# EAGLE design sumorobot-shield-pcb (EAGLE 6.5.0)
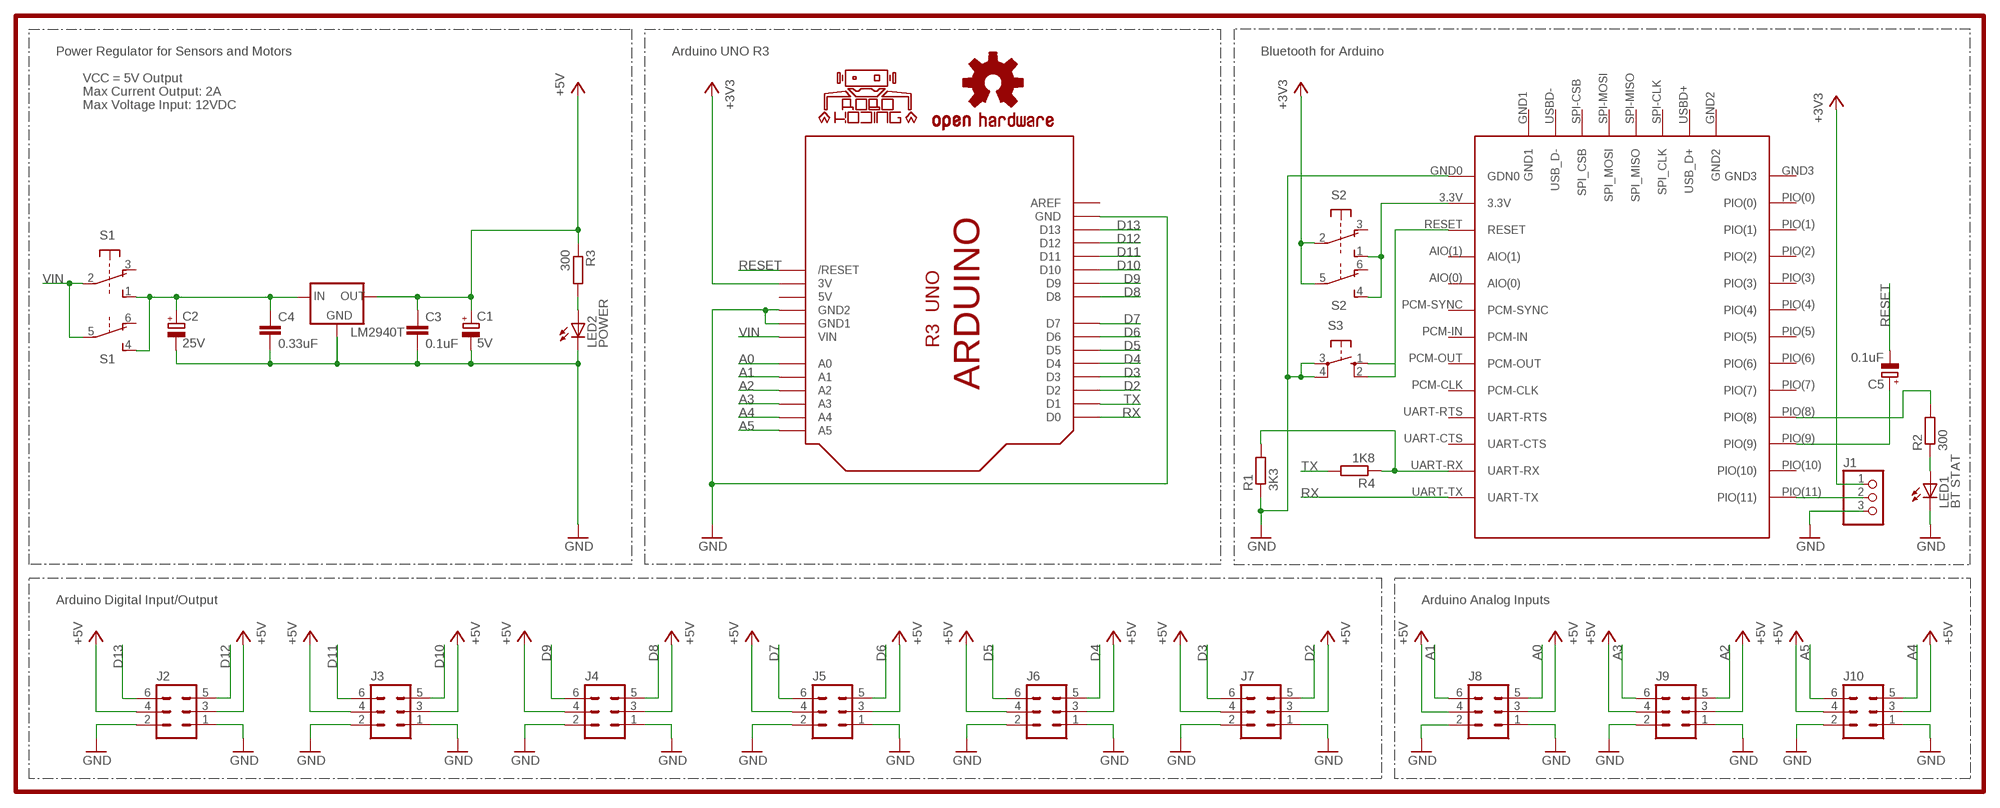
[diagram p0: schematic, sheet 1]

## Parts
BLUETOOTH  MODULE  SKU_80711  [SKU_80711]
C1  5V  CPOL-EUE3.5-8  [E3,5-8]
C2  25V  CPOL-EUE2.5-7  [E2,5-7]
C3  0.1uF  C-EU025-024X044  [C025-024X044]
C4  0.33uF  C-EU025-024X044  [C025-024X044]
C5  0.1uF  CPOL-EUE5-4  [E5-4]
J1  PINHD-1X3  [1X03]
J2  MA03-2  [MA03-2]
J3  MA03-2  [MA03-2]
J4  MA03-2  [MA03-2]
J5  MA03-2  [MA03-2]
J6  MA03-2  [MA03-2]
J7  MA03-2  [MA03-2]
J8  MA03-2  [MA03-2]
J9  MA03-2  [MA03-2]
J10  MA03-2  [MA03-2]
LED1  BT STAT  LED5MM  [LED5MM]
LED2  POWER  LED5MM  [LED5MM]
LM2940T  78XXL  [78XXL]
LOGO1  ROBOKODING-LOGOL  [ROBOKODING-LOGO-L]
LOGO2  OSHW-LOGOL  [OSHW-LOGO-L]
R1  3K3  R-EU_0204/7  [0204/7]
R2  300  R-EU_0204/7  [0204/7]
R3  300  R-EU_0204/7  [0204/7]
R4  1K8  R-EU_0204/7  [0204/7]
S1  9077-2  [9077-2]
S2  9077-2  [9077-2]
S3  10-XX  [B3F-10XX]
U$1  SUMOINO-SHIELD  [SUMOINO-SHIELD]

## Nets
+3V3: J1.1 S2.2(1:P) S2.5(2:P) U$1.3V
A0: J8.5 U$1.A0
A1: J8.6 U$1.A1
A2: J9.5 U$1.A2
A3: J9.6 U$1.A3
A4: J10.5 U$1.A4
A5: J10.6 U$1.A5
D2: J7.5 U$1.D2
D3: J7.6 U$1.D3
D4: J6.5 U$1.D4
D5: J6.6 U$1.D5
D6: J5.5 U$1.D6
D7: J5.6 U$1.D7
D8: J4.5 U$1.D8
D9: J4.6 U$1.D9
D10: J3.5 U$1.D10
D11: J3.6 U$1.D11
D12: J2.5 U$1.D12
D13: J2.6 U$1.D13
GND: BLUETOOTH.GND0(GDN0) C1.- C2.- C3.2 C4.2 J1.3 J2.1 J2.2 J3.1 J3.2 J4.1 J4.2 J5.1 J5.2 J6.1 J6.2 J7.1 J7.2 J8.1 J8.2 J9.1 J9.2 J10.1 J10.2 LED1.K(C) LED2.K(C) LM2940T.GND R1.1 S3.3(P) S3.4(P1) U$1.GND U$1.GND1 U$1.GND2
N$1: BLUETOOTH.3.3V S2.1(1:S) S2.4(2:S)
N$2: BLUETOOTH.RESET S3.1(S) S3.2(S1)
N$3: LED2.A R3.2
N$4: BLUETOOTH.PIO(9) C5.+
N$5: C2.+ C4.1 LM2940T.IN S1.1(1:S) S1.4(2:S)
N$10: BLUETOOTH.PIO(8) R2.2
N$14: BLUETOOTH.UART-RX R1.2 R4.1
N$15: LED1.A R2.1
N$18: BLUETOOTH.PIO(11) J1.2
RESET: C5.- U$1.RESET(/RESET)
RX: BLUETOOTH.UART-TX U$1.D0
TX: R4.2 U$1.D1
VCC: C1.+ C3.1 J2.3 J2.4 J3.3 J3.4 J4.3 J4.4 J5.3 J5.4 J6.3 J6.4 J7.3 J7.4 J8.3 J8.4 J9.3 J9.4 J10.3 J10.4 LM2940T.OUT R3.1 ; supply symbol labelled +5V
VIN: S1.2(1:P) S1.5(2:P) U$1.VIN
Unconnected: BLUETOOTH.AIO(0) BLUETOOTH.AIO(1) BLUETOOTH.GND1 BLUETOOTH.GND2 BLUETOOTH.GND3 BLUETOOTH.PCM-CLK BLUETOOTH.PCM-IN BLUETOOTH.PCM-OUT BLUETOOTH.PCM-SYNC BLUETOOTH.PIO(0) BLUETOOTH.PIO(1) BLUETOOTH.PIO(2) BLUETOOTH.PIO(3) BLUETOOTH.PIO(4) BLUETOOTH.PIO(5) BLUETOOTH.PIO(6) BLUETOOTH.PIO(7) BLUETOOTH.PIO(10) BLUETOOTH.SPI-CLK(SPI_CLK) BLUETOOTH.SPI-CSB(SPI_CSB) BLUETOOTH.SPI-MISO(SPI_MISO) BLUETOOTH.SPI-MOSI(SPI_MOSI) BLUETOOTH.UART-CTS BLUETOOTH.UART-RTS BLUETOOTH.USBD+(USB_D+) BLUETOOTH.USBD-(USB_D-) S1.3(1:O) S1.6(2:O) S2.3(1:O) S2.6(2:O) U$1.AREF

## Notes on the sheet
- Power Regulator for Sensors and Motors | Arduino UNO R3 | Bluetooth for Arduino
- VCC = 5V Output
- Max Current Output: 2A
- Max Voltage Input: 12VDC
- Arduino Digital Input/Output | Arduino Analog Inputs

## Power pins joined to a net without a drawn wire
5V: U$1.5V

## Library data of the parts
BLUETOOTH = Bluetooth_serial:SKU_80711
C1 C2 C5 = rcl:CPOL-EU: POLARIZED CAPACITOR, European symbol
C3 C4 = rcl:C-EU: CAPACITOR, European symbol
J1 = pinhead:PINHD-1X3: PIN HEADER
J2-J10 = con-lstb:MA03-2: PIN HEADER; OC_FARNELL: unknown; OC_NEWARK: unknown
LED1 LED2 = led:LED: LED OSRAM: - CHIPLED LG R971, LG N971, LY N971, LG Q971, LY Q971, LO R971, LY R971 LH N974, LH R974 LS Q976, LO Q976, LY Q976 LO Q996 - Hyper CHIPLED LW Q18S LB Q993, LB Q99A, LB R99A - SideLED LS A670, LO A670, LY A670, LG A670, LP A670 LB A673, LV A673, LT A673, LW A673 LH A674 LY A675 LS A676, LA A676, LO A676, LY A676, LW A676 LS A679, LY A679, LG A679 - Hyper Micro SIDELED® LS Y876, LA Y876, LO Y876, LY Y876 LT Y87S - SmartLED LW L88C, LW L88S LB L89C, LB L89S, LG L890 LS L89K, LO L89K, LY L89K LS L896, LA L896, LO L896, LY L896 - TOPLED LS T670, LO T670, LY T670, LG T670, LP T670 LSG T670, LSP T670, LSY T670, LOP T670, LYG T670 LG T671, LOG T671, LSG T671 LB T673, LV T673, LT T673, LW T673 LH T674 LS T676, LA T676, LO T676, LY T676, LB T676, LH T676, LSB T676, LW T676 LB T67C, LV T67C, LT T67C, LS T67K, LO T67K, LY T67K, LW E67C LS E67B, LA E67B, LO E67B, LY E67B, LB E67C, LV E67C, LT E67C LW T67C LS T679, LY T679, LG T679 LS T770, LO T770, LY T770, LG T770, LP T770 LB T773, LV T773, LT T773, LW T773 LH T774 LS E675, LA E675, LY E675, LS T675 LS T776, LA T776, LO T776, LY T776, LB T776 LHGB T686 LT T68C, LB T68C - Hyper Mini TOPLED® LB M676 - Mini TOPLED Santana® LG M470 LS M47K, LO M47K, LY M47K Source: http://www.osram.convergy.de LUXEON: - LUMILED® LXK2-PW12-R00, LXK2-PW12-S00, LXK2-PW14-U00, LXK2-PW14-V00 LXK2-PM12-R00, LXK2-PM12-S00, LXK2-PM14-U00 LXK2-PE12-Q00, LXK2-PE12-R00, LXK2-PE12-S00, LXK2-PE14-T00, LXK2-PE14-U00 LXK2-PB12-K00, LXK2-PB12-L00, LXK2-PB12-M00, LXK2-PB14-N00, LXK2-PB14-P00, LXK2-PB14-Q00 LXK2-PR12-L00, LXK2-PR12-M00, LXK2-PR14-Q00, LXK2-PR14-R00 LXK2-PD12-Q00, LXK2-PD12-R00, LXK2-PD12-S00 LXK2-PH12-R00, LXK2-PH12-S00 LXK2-PL12-P00, LXK2-PL12-Q00, LXK2-PL12-R00 Source: www.luxeon.com KINGBRIGHT: KA-3528ASYC Source: www.kingbright.com
LM2940T = v-reg:78XXL: VOLTAGE REGULATOR
LOGO1 = robokoding-logo:ROBOKODING-LOGO: Robokoding logo This logo indicates that the piece of hardware was developed by the RoboKoding community. RoboKoding is a organisation that focuses on teaching everyone building and programming robots: http://www.robokoding.com
LOGO2 = SparkFun-Aesthetics:OSHW-LOGO: Open Source Hardware Logo This logo indicates the piece of hardware it is found on incorporates a OSHW license and/or adheres to the definition of open source hardware found here: http://freedomdefined.org/OSHW
R1-R4 = rcl:R-EU_: RESISTOR, European symbol
S1 S2 = switch-misc:9077-2: MARQUARDT SWITCH 9077.0200 Distributor: Buerklin <https://www.buerklin.com/default.asp?event=ShowArtikel%2812G2822%29&l=d&jump=ArtNr_12G2822>
S3 = switch-omron:10-XX: OMRON SWITCH; MPN: B3F-1000; OC_FARNELL: 176432; OC_NEWARK: 36M3542
U$1 = arduino_uno:SUMOINO-SHIELD: Sumoino shield Sumoino shield for Arduino Uno, the shield adds bluetooth connectivity and an additional voltage regulator for motors.

## Board
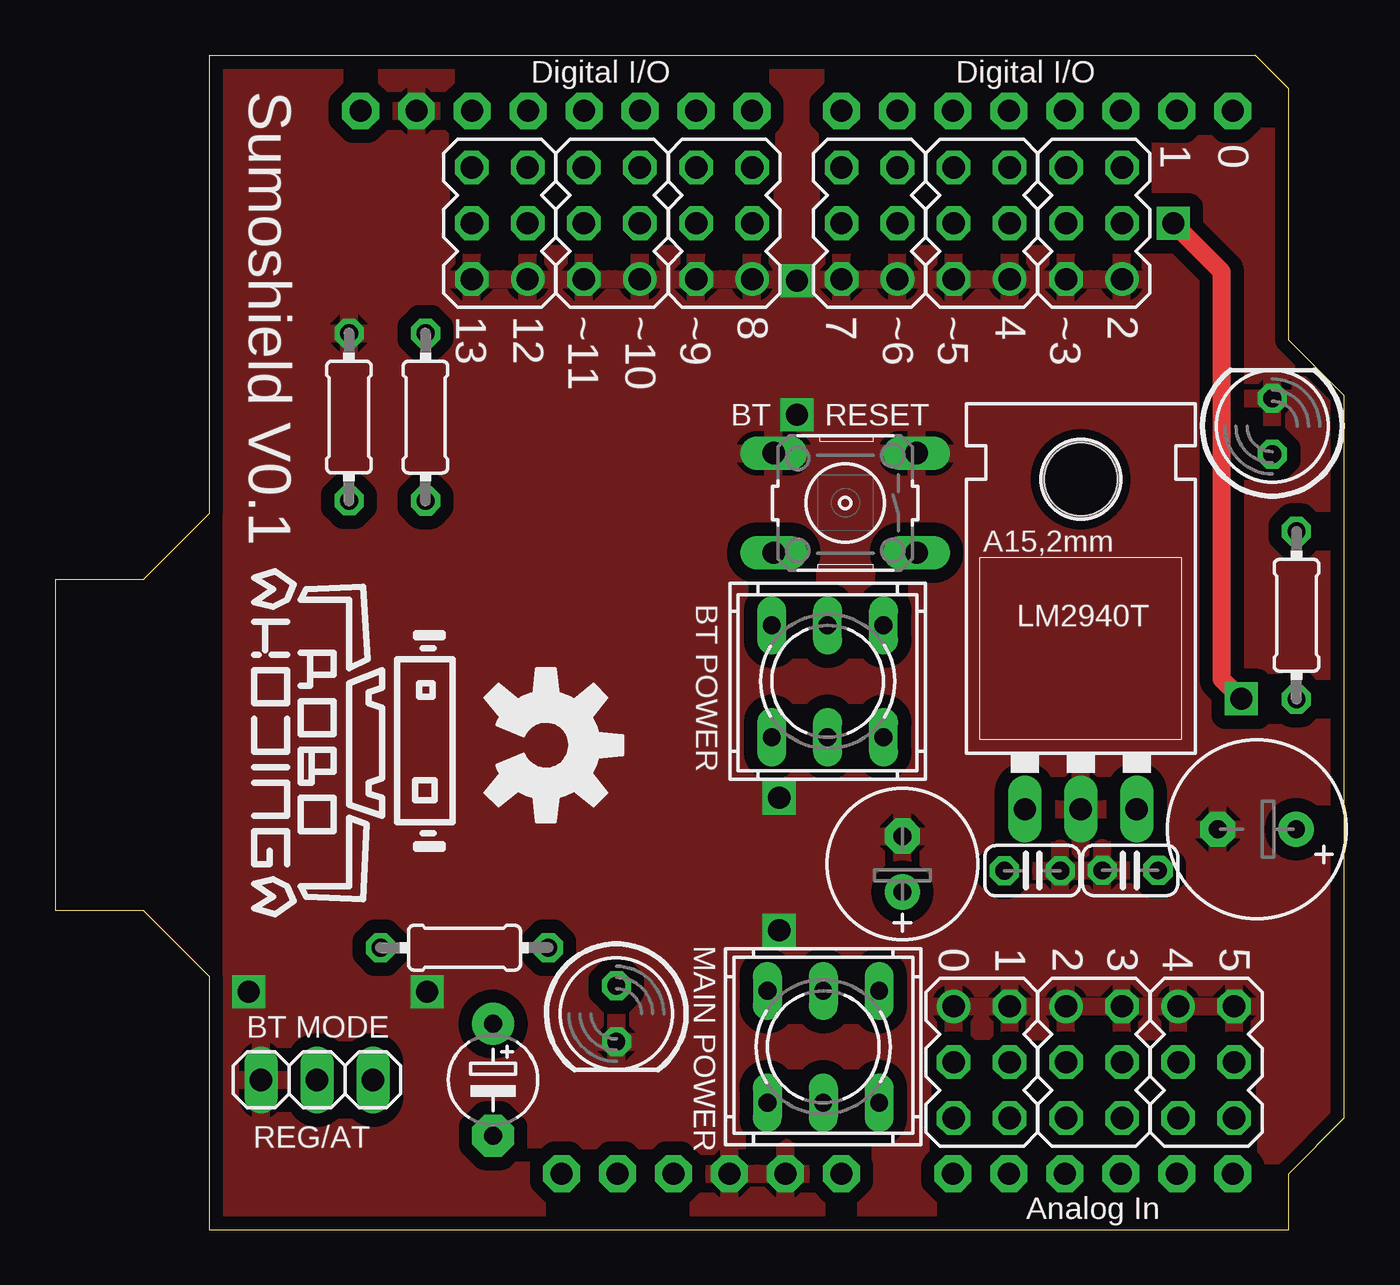
[diagram p1: board, top side]
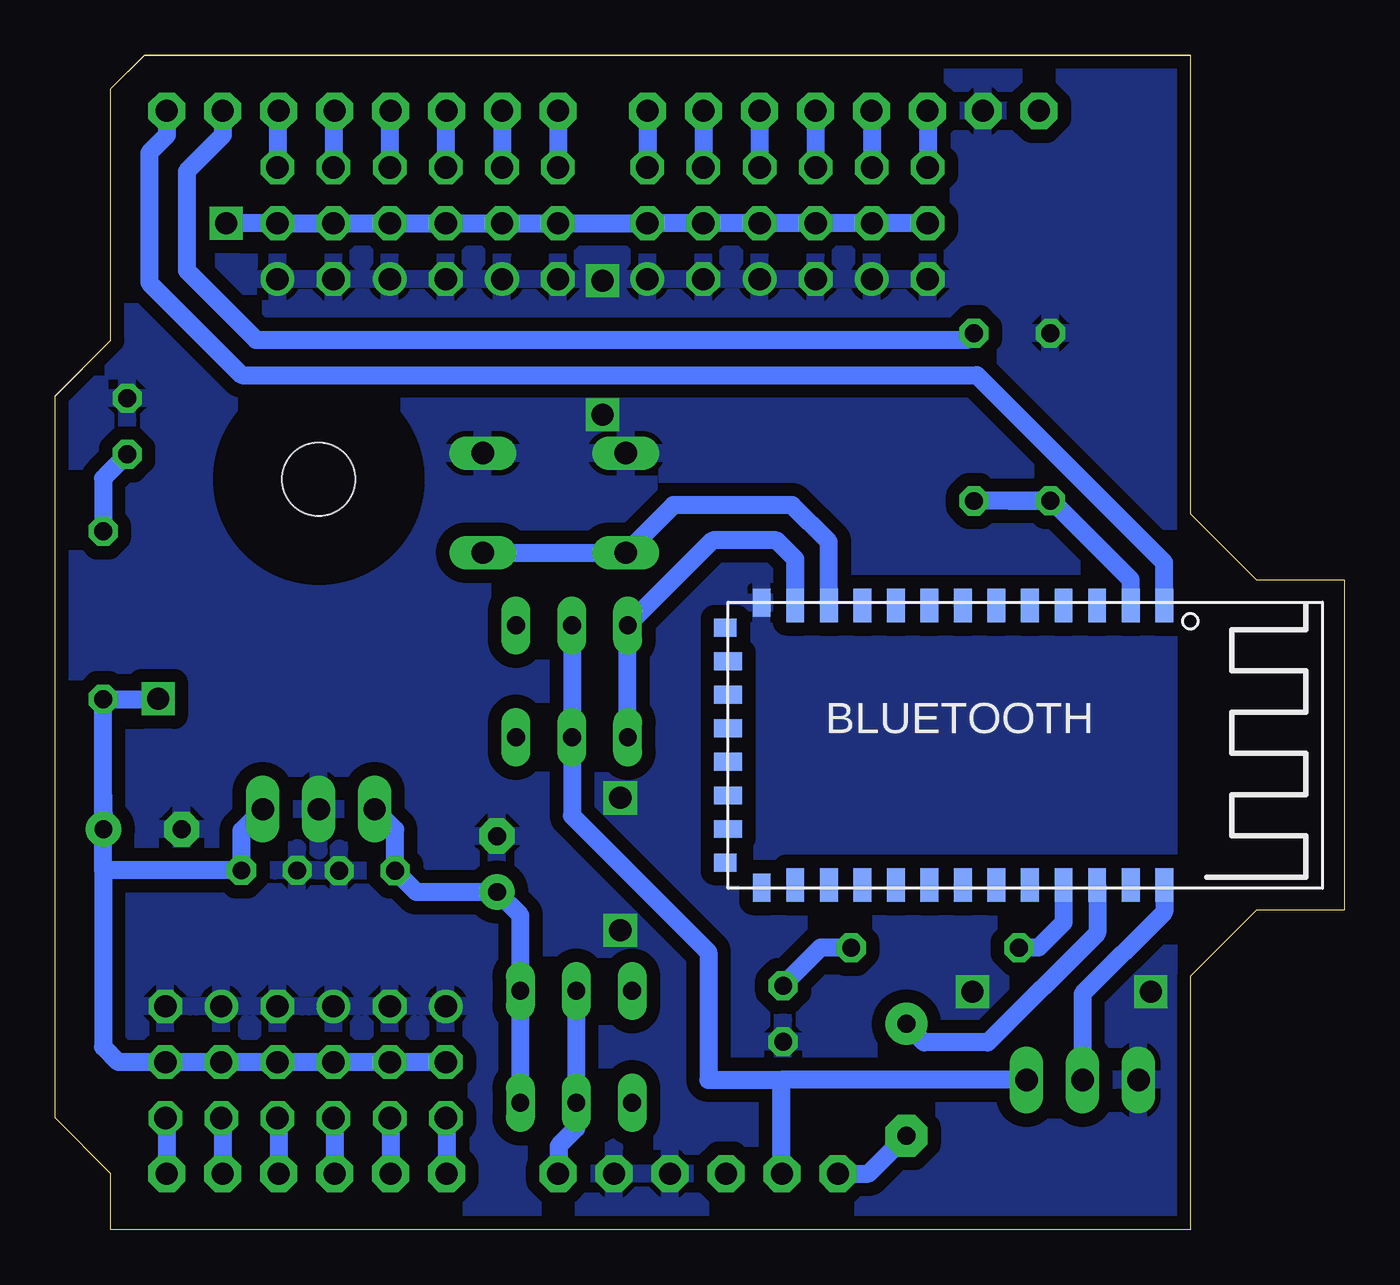
[diagram p2: board, bottom side, seen from below]

Size 58.58 x 53.34 mm. Coordinates in mm from the lower left corner, seen from the top.
Outline: 7,0 56.04,0 56.04,2.54 58.58,5.08 58.58,37.86 56.04,40.39 56.04,51.82 54.52,53.34 7,53.34 7,32.5 4,29.5 0,29.5 0,14.5 4,14.5 7,11.5 7,0
Copper layers (1*16): Top 0.035mm / dielectric 1.5mm / Bottom 0.035mm
Design rules "dirt_cheap_dirty_boards.v1": minimum track width 5mil, minimum drill 12mil, track to track 5mil, track to pad 5mil, pad to pad 5mil, via to via 5mil, smd to smd 0mil, copper to edge 10mil, drill to drill 10mil, minimum pad ring 10mil, minimum via ring 6mil, stop-mask expansion 2mil, vias tented up to drill 25mil, thermal gap 10mil

### Footprints (pad centres in the part's own frame; a part is rotated, then mirrored left to right if it is on the bottom)
SKU_80711 = smd 1.524 x 0.813: 3.3V -6.35,3.048; AIO(0) -6.35,7.62; AIO(1) -6.35,6.096; PCM-CLK -6.35,13.716; PCM-IN -6.35,10.668; PCM-OUT -6.35,12.192; PCM-SYNC -6.35,9.144; PIO(0) 6.35,3.048; PIO(1) 6.35,4.572; PIO(2) 6.35,6.096; PIO(3) 6.35,7.62; PIO(4) 6.35,9.144; PIO(5) 6.35,10.668; PIO(6) 6.35,12.192; PIO(7) 6.35,13.716; PIO(8) 6.35,15.24; PIO(9) 6.35,16.764; PIO(10) 6.35,18.288; PIO(11) 6.35,19.812; RESET -6.35,4.572; UART-CTS -6.35,16.764; UART-RTS -6.35,15.24; UART-RX -6.35,18.288; UART-TX -6.35,19.812 | smd 1.27 x 0.813: GND0 -6.477,1.524; GND3 6.477,1.524 | smd 0.813 x 1.016: GND1 -5.334,-0.127; GND2 5.334,-0.127 | smd 0.813 x 1.27: SPI-CLK 2.286,0; SPI-CSB -2.286,0; SPI-MISO 0.762,0; SPI-MOSI -0.762,0; USBD+ 3.81,0; USBD- -3.81,0
E3,5-8 = drill 0.813 pad 1.6: + -1.778,0 | drill 0.813 pad 1.6 octagon: - 1.778,0
E2,5-7 = drill 0.813 pad 1.6: + -1.27,0 | drill 0.813 pad 1.6 octagon: - 1.27,0
C025-024X044 = drill 0.813 octagon: 1 -1.27,0; 2 1.27,0
E5-4 = drill 0.813 pad 1.905: + -2.54,0 | drill 0.813 pad 1.905 octagon: - 2.54,0
1X03 = drill 1.016 long: 1 -2.54,0; 2 0,0; 3 2.54,0
MA03-2 = drill 1.016: 1 -2.54,-1.27 | drill 1.016 octagon: 2 -2.54,1.27; 3 0,-1.27; 4 0,1.27; 5 2.54,-1.27; 6 2.54,1.27
LED5MM = drill 0.813 octagon: A -1.27,0; K 1.27,0
78XXL = drill 1.016 long: GND 0,-3.81; IN -2.54,-3.81; OUT 2.54,-3.81 | hole 3.302: 0,11.176
0204/7 = drill 0.813 octagon: 1 -3.81,0; 2 3.81,0
9077-2 = drill 0.813 long: 1 -2.54,2.54; 2 0,2.54; 3 2.54,2.54; 4 -2.54,-2.54; 5 0,-2.54; 6 2.54,-2.54
B3F-10XX = drill 1.016 long: 1 -3.251,2.261; 2 3.251,2.261; 3 -3.251,-2.261; 4 3.251,-2.261
SUMOINO-SHIELD = drill 1 pad 1.676 octagon: 3V 18.56,2.54; 5V 21.1,2.54; A0 33.8,2.54; A1 36.34,2.54; A2 38.88,2.54; A3 41.42,2.54; A4 43.96,2.54; A5 46.5,2.54; AREF 6.876,50.8; D0 46.5,50.8; D1 43.96,50.8; D2 41.42,50.8; D3 38.88,50.8; D4 36.34,50.8; D5 33.8,50.8; D6 31.26,50.8; D7 28.72,50.8; D8 24.656,50.8; D9 22.116,50.8; D10 19.576,50.8; D11 17.036,50.8; D12 14.496,50.8; D13 11.956,50.8; GND 9.416,50.8; GND1 26.18,2.54; GND2 23.64,2.54; RESET 16.02,2.54; VIN 28.72,2.54

### Placement (x,y rotation side)
BLUETOOTH  28,22 270 bottom
C1  54.6,18.18 180 top
C2  38.5,16.6 90 top
C3  48.84,16.31 180 top
C4  44.4,16.3 0 top
C5  19.9,6.8 270 top
J1  11.9,6.8 180 top
J2  20.2,45.7 90 top
J3  25.3,45.7 90 top
J4  30.4,45.7 90 top
J5  37,45.7 90 top
J6  42.1,45.7 90 top
J7  47.2,45.7 90 top
J8  42.1,7.6 270 top
J9  47.2,7.6 270 top
J10  52.3,7.6 270 top
LED1  25.5,9.8 270 top
LED2  55.3,36.48 90 top
LM2940T  46.6,22.9 0 top
LOGO1  8.85,30.1 270 top
LOGO2  22.3,22 270 top
R1  13.35,36.9 270 top
R2  18.6,12.8 180 top
R3  56.4,27.9 90 top
R4  16.83,36.9 90 top
S1  34.9,8.3 180 top
S2  35.1,24.9 0 top
S3  35.9,33 180 top
U$1  7,0 0 top

### Tracks (layer width: path | path; a pad name or v marks a point on that pad's centre or on a via)
+3V3
  Bottom 0.813: J1.1 25.6,6.8 | 25.6,6.8 25.6,2.58 U$1.3V | S2.2 S2.5 35.1,18.8 28.9,12.6 28.9,6.8 25.6,6.8
A0
  Bottom 0.813: J8.5 40.8,5.06 U$1.A0
A1
  Bottom 0.813: J8.6 43.34,5.06 U$1.A1
A2
  Bottom 0.813: J9.5 45.88,5.06 U$1.A2
A3
  Bottom 0.813: J9.6 48.42,5.06 U$1.A3
A4
  Bottom 0.813: J10.5 50.96,5.06 U$1.A4
A5
  Bottom 0.813: J10.6 53.5,5.06 U$1.A5
D2
  Bottom 0.813: U$1.D2 48.47,50.75 J7.5
D3
  Bottom 0.813: U$1.D3 45.93,50.75 J7.6
D4
  Bottom 0.813: U$1.D4 43.37,50.77 J6.5
D5
  Bottom 0.813: U$1.D5 40.83,50.77 J6.6
D6
  Bottom 0.813: U$1.D6 J5.5
D7
  Bottom 0.813: U$1.D7 J5.6
D8
  Bottom 0.813: U$1.D8 J4.5
D9
  Bottom 0.813: U$1.D9 J4.6
D10
  Bottom 0.813: U$1.D10 J3.5
D11
  Bottom 0.813: U$1.D11 J3.6
D12
  Bottom 0.813: U$1.D12 21.47,50.8 J2.5
D13
  Bottom 0.813: U$1.D13 18.93,50.8 J2.6
GND  (via drill 1)
  other vias: 33.7,43.1 33.7,37 16.9,10.8 8.8,10.8 32.9,13.6 32.9,19.6
  pour Bottom (isolate 0.61): 8,0 59,0 59,54 8,54
  pour Top (isolate 0.61): 8,54 8,0 59,0 59,54
N$1
  Bottom 0.813: BLUETOOTH.3.3V 24.95,30.45 25.8,31.3 28.7,31.3 S2.1 S2.4
N$2
  Bottom 0.813: S3.1 S3.2 30.49,32.9 25.1,32.9 23.43,31.23 BLUETOOTH.RESET
N$3
  Bottom 0.813: LED2.A 56.26,34.25 56.26,34.24 56.4,34.1 R3.2
N$4
  Bottom 0.813: BLUETOOTH.PIO(9) 11.24,13.46 16.2,8.5 19.1,8.5 19.9,9.3 C5.+
N$5
  Bottom 0.813: S1.1 S1.4 37.44,14.27 C2.+ 42.16,15.33 C4.1 43.13,18.16 LM2940T.IN
N$10
  Bottom 0.813: BLUETOOTH.PIO(8) 12.76,13.94 13.9,12.8 R2.2
N$14
  Bottom 0.813: BLUETOOTH.UART-RX 9.71,29.51 13.3,33.1 15.29,33.1 R1.2 R4.1
N$15
  Bottom 0.813: R2.1 23.8,12.8 25.5,11.1 LED1.A
N$18
  Bottom 0.813: BLUETOOTH.PIO(11) 8.19,14.41 11.9,10.7 J1.2
RESET
  Bottom 0.813: U$1.RESET 21.62,2.54 C5.-
RX
  Bottom 0.813: U$1.D0 53.5,49.7 54.3,48.9 54.3,43 50.1,38.8 16.7,38.8 8.2,30.3 8.2,28.36 BLUETOOTH.UART-TX
TX
  Bottom 0.813: U$1.D1 50.96,49.7 52.59,48.06 52.59,43.56 49.45,40.4 17.15,40.4 R4.2
VCC  (via drill 1)
  Top 0.813: v53.9,24.1 53,25 53,43.5 v50.8,45.7
  Bottom 0.813: J2.4 J2.3 J3.4 J3.3 J4.4 J4.3 J5.4 J5.3 J6.4 J6.3 J7.4 J7.3 v50.8,45.7 | LM2940T.OUT 50.11,18.12 C3.1 56.39,16.31 56.4,16.3 | 56.4,16.3 56.4,19.75 | 56.4,19.75 C1.+ | 56.4,16.3 56.4,8.3 55.7,7.6 J10.4 J10.3 J9.4 J9.3 J8.3 J8.4 | 56.4,19.75 R3.1 v53.9,24.09 v53.9,24.1
VIN
  Bottom 0.813: S1.5 S1.2 34.9,4.6 35.7,3.8 35.7,2.56 U$1.VIN

### Text on the board
tPlace: Sumoshield V0.1 | 1 | 0 | 13 | 12 | ~11 | ~10 | ~9 | 8 | 7 | ~6 | ~5 | 4 | ~3 | 2 | BT RESET | BT POWER | MAIN POWER | 0 | 1 | 2 | 3 | 4 | 5 | BT MODE | REG/AT